# EAGLE schematic Battery_Monitoring_V2 (EAGLE 9.5.1)

## Sheet 1 of 2
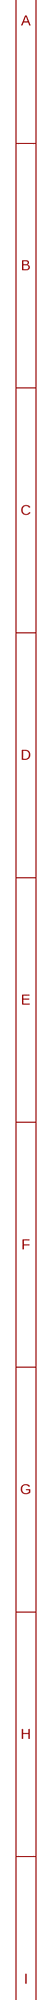
[diagram p0: schematic, sheet 1, part 1 of 2]
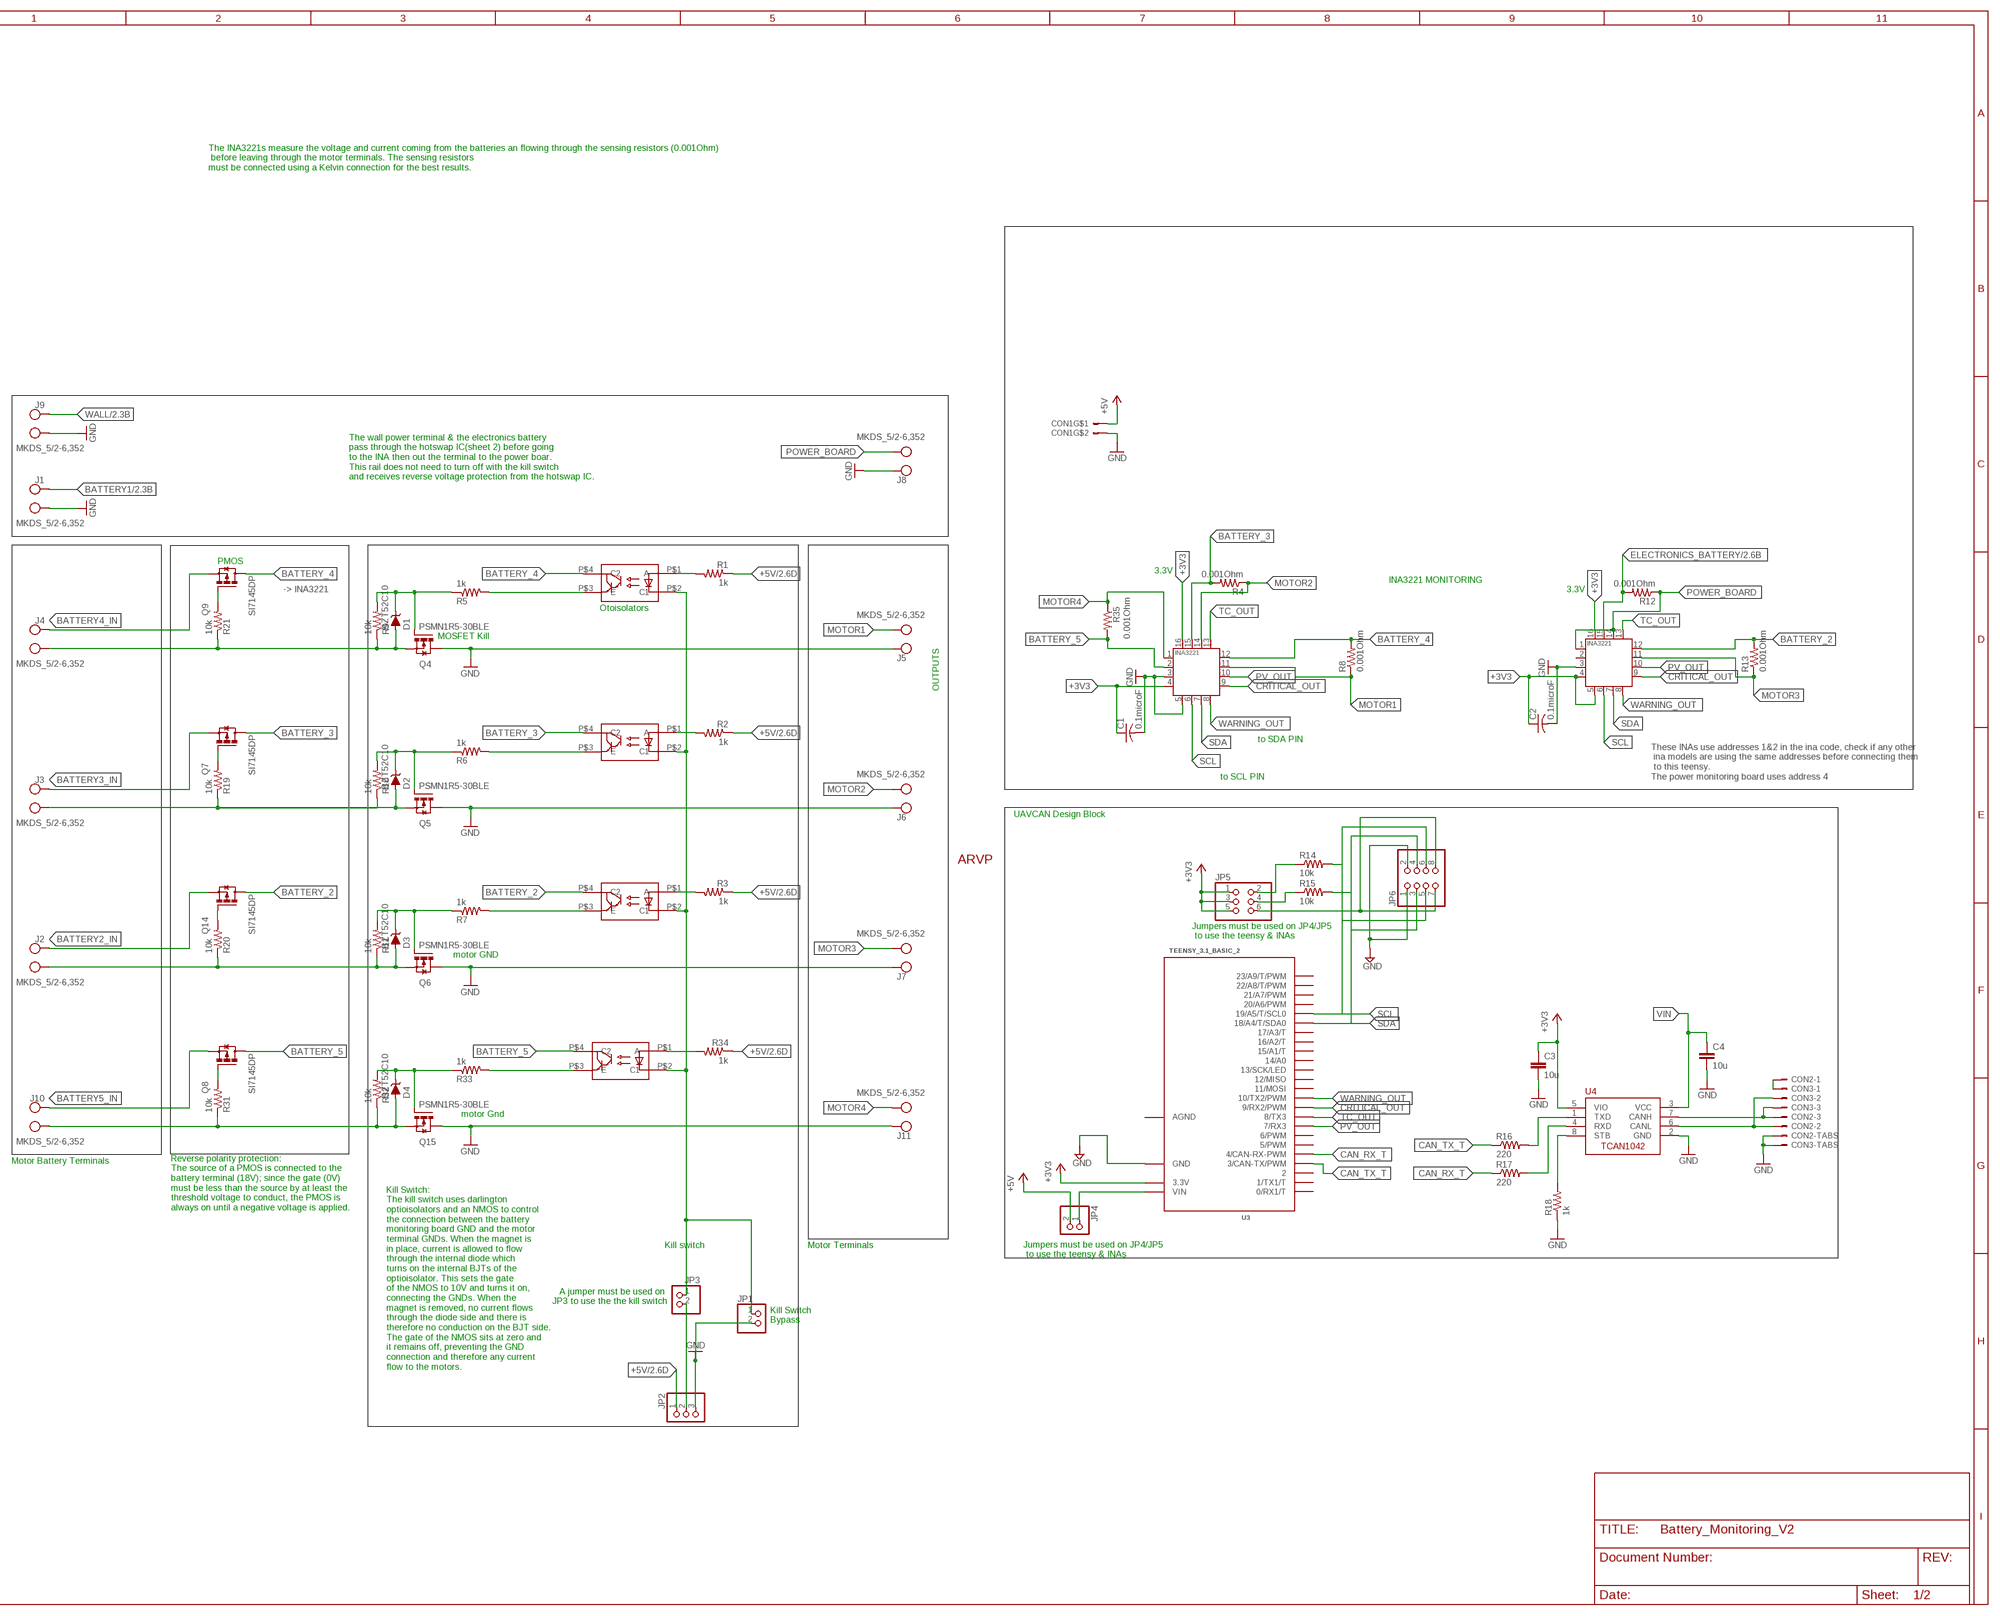
[diagram p1: schematic, sheet 1, part 2 of 2]

### Parts
ARVP1  ARVP_LOGO  [ARVP]
C1  0.1microF  C-USC2012  [C2012]
C2  0.1microF  C-USC2012  [C2012]
C3  10u  C-EUC0805  [C0805]
C4  10u  C-EUC0805  [C0805]
CON1  MOLEX_5566-2  [5566-2]
CON2  SM03B-GHS-TB  [SM03B-GHS-TB]
CON3  SM03B-GHS-TB  [SM03B-GHS-TB]
D1  BZT52C10  [SOD-123]
D2  BZT52C10  [SOD-123]
D3  BZT52C10  [SOD-123]
D4  BZT52C10  [SOD-123]
J1  MKDS_5/2-6,352  [MKDS_5/2-6,35]
J2  MKDS_5/2-6,352  [MKDS_5/2-6,35]
J3  MKDS_5/2-6,352  [MKDS_5/2-6,35]
J4  MKDS_5/2-6,352  [MKDS_5/2-6,35]
J5  MKDS_5/2-6,352  [MKDS_5/2-6,35]
J6  MKDS_5/2-6,352  [MKDS_5/2-6,35]
J7  MKDS_5/2-6,352  [MKDS_5/2-6,35]
J8  MKDS_5/2-6,352  [MKDS_5/2-6,35]
J9  MKDS_5/2-6,352  [MKDS_5/2-6,35]
J10  MKDS_5/2-6,352  [MKDS_5/2-6,35]
J11  MKDS_5/2-6,352  [MKDS_5/2-6,35]
JP1  PINHD-1X2  [1X02]
JP2  PINHD-1X3  [1X03]
JP3  PINHD-1X2  [1X02]
JP4  PINHD-1X2  [1X02]
JP5  PINHD-2X3  [2X03]
JP6  PINHD-2X4  [2X04]
Q1  TCLD1000CT  [SOP-4L]
Q2  TCLD1000CT  [SOP-4L]
Q3  TCLD1000CT  [SOP-4L]
Q4  PSMN1R5-30BLE  [SOT404/D2PAK]
Q5  PSMN1R5-30BLE  [SOT404/D2PAK]
Q6  PSMN1R5-30BLE  [SOT404/D2PAK]
Q7  SI7145DP  [SO-8/PPAK/TEST]
Q8  SI7145DP  [SO-8/PPAK/TEST]
Q9  SI7145DP  [SO-8/PPAK/TEST]
Q14  SI7145DP  [SO-8/PPAK/TEST]
Q15  PSMN1R5-30BLE  [SOT404/D2PAK]
Q16  TCLD1000CT  [SOP-4L]
R1  1k  R-US_R0805  [R0805]
R2  1k  R-US_R0805  [R0805]
R3  1k  R-US_R0805  [R0805]
R4  0.001Ohm  HCS3920FT1L00  [3920]
R5  1k  R-US_M1206  [M1206]
R6  1k  R-US_M1206  [M1206]
R7  1k  R-US_M1206  [M1206]
R8  0.001Ohm  HCS3920FT1L00  [3920]
R9  10k  R-US_M1206  [M1206]
R10  10k  R-US_M1206  [M1206]
R11  10k  R-US_M1206  [M1206]
R12  0.001Ohm  HCS3920FT1L00  [3920]
R13  0.001Ohm  HCS3920FT1L00  [3920]
R14  10k  R-US_R1206  [R1206]
R15  10k  R-US_R1206  [R1206]
R16  220  R-US_R0805  [R0805]
R17  220  R-US_R0805  [R0805]
R18  1k  R-US_R0805  [R0805]
R19  10k  R-US_M1206  [M1206]
R20  10k  R-US_M1206  [M1206]
R21  10k  R-US_M1206  [M1206]
R31  10k  R-US_M1206  [M1206]
R32  10k  R-US_M1206  [M1206]
R33  1k  R-US_M1206  [M1206]
R34  1k  R-US_R0805  [R0805]
R35  0.001Ohm  HCS3920FT1L00  [3920]
U1  INA3221.  [HVQFN16_4X4]
U2  INA3221.  [HVQFN16_4X4]
U3  TEENSY_3.1_BASIC_2  [TEENSY_3.1_BASIC_2]
U4  TCAN1042HVDR  [SO-8]

### Nets
+3V3: C1.1 C2.1 C3.1 JP5.1 JP5.3 JP5.5 U1.4(VS) U1.16(VPU) U2.4(VS) U2.5(A0) U2.16(VPU) U3.3.3V U4.5(VIO)
+5V: CON1.1 JP2.1 JP4.2 R1.1 R2.1 R3.1 ; also sheet 2
+5V/2.6D: R34.1
BATT1GND: D1.P$2(A) J4.1(KL) Q4.3S(S) R9.1 R21.1
BATT2GND: D2.P$2(A) J3.1(KL) Q5.3S(S) R10.1 R19.1
BATT3GND: D3.P$2(A) J2.1(KL) Q6.3S(S) R11.1 R20.1
BATTERY1: J1.2(KL1) ; also sheet 2
BATTERY2_IN: J2.2(KL1) Q14.S@1(S) Q14.S@2(S) Q14.S@3(S)
BATTERY3_IN: J3.2(KL1) Q7.S@1(S) Q7.S@2(S) Q7.S@3(S)
BATTERY4_IN: J4.2(KL1) Q9.S@1(S) Q9.S@2(S) Q9.S@3(S)
BATTERY5_IN: J10.2(KL1) Q8.S@1(S) Q8.S@2(S) Q8.S@3(S)
BATTERY_2: Q3.P$4(C2) Q14.D@1(D) Q14.D@2(D) Q14.D@3(D) Q14.D@4(D) Q14.D@5(D) R13.P$2 U2.12(IN+1)
BATTERY_3: Q2.P$4(C2) Q7.D@1(D) Q7.D@2(D) Q7.D@3(D) Q7.D@4(D) Q7.D@5(D) R4.P$2 U1.15(IN+2)
BATTERY_4: Q1.P$4(C2) Q9.D@1(D) Q9.D@2(D) Q9.D@3(D) Q9.D@4(D) Q9.D@5(D) R8.P$2 U1.12(IN+1)
BATTERY_5: Q8.D@1(D) Q8.D@2(D) Q8.D@3(D) Q8.D@4(D) Q8.D@5(D) Q16.P$4(C2) R35.P$2 U1.2(IN+3)
CAN_RX1: R17.2 U4.4(RXD)
CAN_RX_T: R17.1 U3.4(4/CAN-RX-PWM)
CAN_TX2: R16.2 U4.1(TXD)
CAN_TX_T: R16.1 U3.3(3/CAN-TX/PWM)
CANH1: CON2.P$3 CON3.P$3 U4.7(CANH)
CANL1: CON2.P$2 CON3.P$2 U4.6(CANL)
CANSH1: CON2.P$1 CON3.P$1
CRITICAL_OUT: U1.9(CRITICAL) U2.9(CRITICAL) U3.9(9/RX2/PWM)
E1: Q1.P$3(E) R5.2
E2: Q2.P$3(E) R6.2
E3: Q3.P$3(E) R7.2
ELECTRONICS_BATTERY: R12.P$2 U2.15(IN+2) ; also sheet 2
GND: C1.2 C2.2 C3.2 C4.2 CON1.2 CON2.P$4 CON2.P$5 CON3.P$4 CON3.P$5 J1.1(KL) J5.2(KL1) J6.2(KL1) J7.2(KL1) J8.2(KL1) J9.1(KL) J11.2(KL1) JP1.2 JP2.3 JP6.1 JP6.2 Q4.2D(D) Q5.2D(D) Q6.2D(D) Q15.2D(D) R18.1 U1.3(GND) U1.5(A0) U2.3(GND) U3.GND U4.2(GND) ; also sheet 2
I2C_3V1: JP5.6 JP6.7 JP6.8
MG1: D1.P$1(C) Q4.1G(G) R5.1 R9.2
MG2: D2.P$1(C) Q5.1G(G) R6.1 R10.2
MG3: D3.P$1(C) Q6.1G(G) R7.1 R11.2
MOTOR1: J5.1(KL) R8.P$1 U1.11(IN-1)
MOTOR2: J6.1(KL) R4.P$1 U1.14(IN-2)
MOTOR3: J7.1(KL) R13.P$1 U2.11(IN-1)
MOTOR4: J11.1(KL) R35.P$1 U1.1(IN-3)
N$1: Q1.P$1(A) R1.2
N$2: Q2.P$1(A) R2.2
N$3: Q3.P$1(A) R3.2
N$4: JP1.1 JP3.1 Q1.P$2(C1) Q2.P$2(C1) Q3.P$2(C1) Q16.P$2(C1)
N$5: JP2.2 JP3.2
N$6: Q7.G R19.2
N$7: Q14.G R20.2
N$9: Q9.G R21.2
N$10: Q8.G R31.2
N$12: D4.P$2(A) J10.1(KL) Q15.3S(S) R31.1 R32.1
N$13: D4.P$1(C) Q15.1G(G) R32.2 R33.1
N$15: Q16.P$3(E) R33.2
N$16: Q16.P$1(A) R34.2
POWER_BOARD: J8.1(KL) R12.P$1 U2.1(IN-3) U2.14(IN-2)
PV_OUT: U1.10(PV) U2.10(PV) U3.7(7/RX3)
SCL: JP6.5 JP6.6 R14.2 U1.6(SCL) U2.6(SCL) U3.19/A5(19/A5/T/SCL0)
SCL_3V1: JP5.2 R14.1
SDA: JP6.3 JP6.4 R15.2 U1.7(SDA) U2.7(SDA) U3.18/A4(18/A4/T/SDA0)
SDA_3V1: JP5.4 R15.1
STB1: R18.2 U4.8(STB)
TC_OUT: U1.13(TC) U2.13(TC) U3.8(8/TX3)
VIN: C4.1 JP4.1 U3.VIN U4.3(VCC)
WALL: J9.2(KL1) ; also sheet 2
WARNING_OUT: U1.8(WARNING) U2.8(WARNING) U3.10(10/TX2/PWM)
Unconnected: U2.2(IN+3) U3.0(0/RX1/T) U3.1(1/TX1/T) U3.2 U3.5(5/PWM) U3.6(6/PWM) U3.11(11/MOSI) U3.12(12/MISO) U3.13(13/SCK/LED) U3.14/A0 U3.15/A1(15/A1/T) U3.16/A2(16/A2/T) U3.17/A3(17/A3/T) U3.20/A6(20/A6/PWM) U3.21/A7(21/A7/PWM) U3.22/A8(22/A8/T/PWM) U3.23/A9(23/A9/T/PWM)

### Notes on the sheet
- The INA3221s measure the voltage and current coming from the batteries an flowing through the sensing resistors (0.001Ohm)
   before leaving through the motor terminals. The sensing resistors
  must be connected using a Kelvin connection for the best results.
- The wall power terminal & the electronics battery
  pass through the hotswap IC(sheet 2) before going 
  to the INA then out the terminal to the power boar. 
  This rail does not need to turn off with the kill switch 
  and receives reverse voltage protection from the hotswap IC.
- PMOS
- 3.3V
- INA3221 MONITORING
- -> INA3221 | 3.3V
- Otoisolators
- MOSFET Kill
- OUTPUTS
- to SDA PIN
- to SCL PIN
- These INAs use addresses 1&2 in the ina code, check if any other
   ina models are using the same addresses before connecting them
   to this teensy.
  The power monitoring board uses address 4
- UAVCAN Design Block
- Jumpers must be used on JP4/JP5
   to use the teensy & INAs
- motor GND
- motor Gnd
- Motor Battery Terminals
- Reverse polarity protection:
  The source of a PMOS is connected to the 
  battery terminal (18V); since the gate (0V) 
  must be less than the source by at least the 
  threshold voltage to conduct, the PMOS is 
  always on until a negative voltage is applied.
- Kill switch | Motor Terminals
- Jumpers must be used on JP4/JP5
   to use the teensy & INAs
- A jumper must be used on 
  JP3 to use the the kill switch
- Kill Switch 
  Bypass
- Kill Switch:
  The kill switch uses darlington 
  optioisolators and an NMOS to control 
  the connection between the battery 
  monitoring board GND and the motor 
  terminal GNDs. When the magnet is 
  in place, current is allowed to flow 
  through the internal diode which 
  turns on the internal BJTs of the 
  optioisolator. This sets the gate
  of the NMOS to 10V and turns it on,
  connecting the GNDs. When the 
  magnet is removed, no current flows 
  through the diode side and there is 
  therefore no conduction on the BJT side. 
  The gate of the NMOS sits at zero and 
  it remains off, preventing the GND 
  connection and therefore any current 
  flow to the motors.

## Sheet 2 of 2
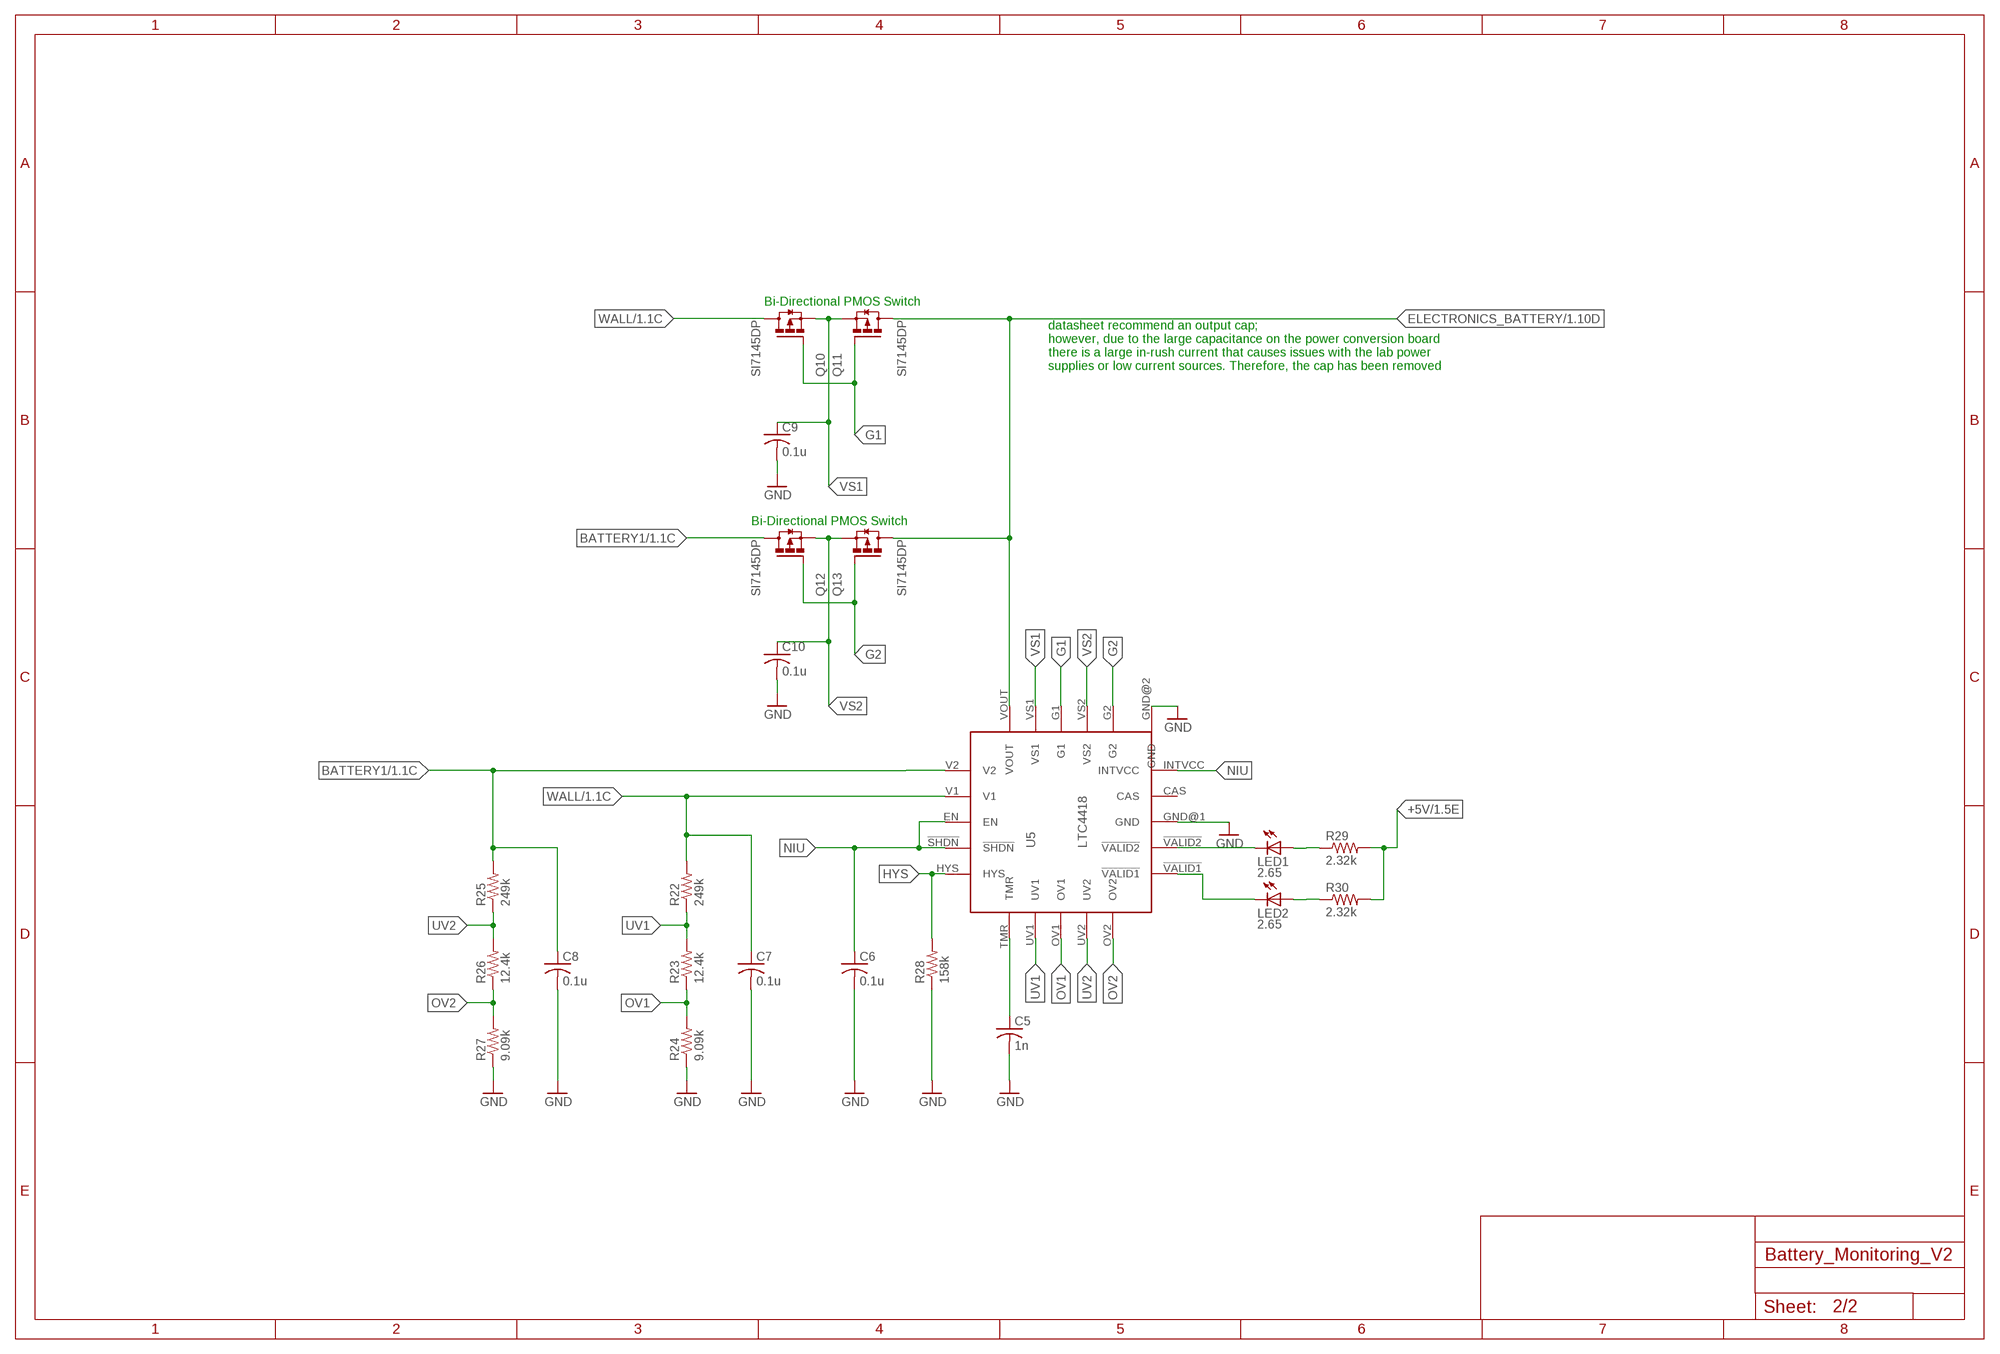
[diagram p2: schematic, sheet 2]

### Parts
C5  1n  C-USC0805  [C0805]
C6  0.1u  C-USC0805  [C0805]
C7  0.1u  C-USC0805  [C0805]
C8  0.1u  C-USC0805  [C0805]
C9  0.1u  C-USC0805  [C0805]
C10  0.1u  C-USC0805  [C0805]
LED1  2.65  LEDSML0805  [SML0805]
LED2  2.65  LEDSML0805  [SML0805]
Q10  SI7145DP  [SO-8/PPAK/TEST]
Q11  SI7145DP  [SO-8/PPAK/TEST]
Q12  SI7145DP  [SO-8/PPAK/TEST]
Q13  SI7145DP  [SO-8/PPAK/TEST]
R22  249k  R-US_R1206  [R1206]
R23  12.4k  R-US_R0805  [R0805]
R24  9.09k  R-US_R0805  [R0805]
R25  249k  R-US_R1206  [R1206]
R26  12.4k  R-US_R0805  [R0805]
R27  9.09k  R-US_R0805  [R0805]
R28  158k  R-US_R0805  [R0805]
R29  2.32k  R-US_R0805  [R0805]
R30  2.32k  R-US_R0805  [R0805]
U5  LTC4418  [20-QFN(4X4)]

### Nets
!VALID1: LED2.C U5.!VALID1
!VALID2: LED1.C U5.!VALID2
+5V: R29.2 R30.2 ; also sheet 1
BATTERY1: C8.1 Q12.D@1(D) Q12.D@2(D) Q12.D@3(D) Q12.D@4(D) Q12.D@5(D) R25.2 U5.V2 ; also sheet 1
ELECTRONICS_BATTERY: Q11.D@1(D) Q11.D@2(D) Q11.D@3(D) Q11.D@4(D) Q11.D@5(D) Q13.D@1(D) Q13.D@2(D) Q13.D@3(D) Q13.D@4(D) Q13.D@5(D) U5.VOUT ; also sheet 1
G1: Q10.G Q11.G U5.G1
G2: Q12.G Q13.G U5.G2
GND: C5.2 C6.2 C7.2 C8.2 C9.2 C10.2 R24.1 R27.1 R28.1 U5.GND@1(GND) U5.GND@2(GND) ; also sheet 1
HYS: R28.2 U5.HYS
N$8: LED1.A R29.1
N$11: LED2.A R30.1
N$14: C5.1 U5.TMR
NIU: C6.1 U5.!SHDN U5.EN U5.INTVCC
OV1: R23.1 R24.2 U5.OV1
OV2: R26.1 R27.2 U5.OV2
UV1: R22.1 R23.2 U5.UV1
UV2: R25.1 R26.2 U5.UV2
VS1: C9.1 Q10.S@1(S) Q10.S@2(S) Q10.S@3(S) Q11.S@1(S) Q11.S@2(S) Q11.S@3(S) U5.VS1
VS2: C10.1 Q12.S@1(S) Q12.S@2(S) Q12.S@3(S) Q13.S@1(S) Q13.S@2(S) Q13.S@3(S) U5.VS2
WALL: C7.1 Q10.D@1(D) Q10.D@2(D) Q10.D@3(D) Q10.D@4(D) Q10.D@5(D) R22.2 U5.V1 ; also sheet 1
Unconnected: U5.CAS

### Notes on the sheet
- Bi-Directional PMOS Switch
- datasheet recommend an output cap;
  however, due to the large capacitance on the power conversion board 
  there is a large in-rush current that causes issues with the lab power 
  supplies or low current sources. Therefore, the cap has been removed
- Bi-Directional PMOS Switch

## Power pins joined to a net without a drawn wire
AGND: U3.AGND

## Library data of the parts
ARVP1 = ARVP:ARVP_LOGO
C1 C2 = resistor:C-US: CAPACITOR, American symbol
C3 C4 = rcl:C-EU: CAPACITOR, European symbol
C5-C10 = adafruit:C-US: CAPACITOR, American symbol
CON1 = ARVP:MOLEX_5566-2
CON2 CON3 = ARVP:SM03B-GHS-TB
D1-D4 = Moira:BZT52C10: DIODE ZENER 10V 500MW SOD123 by Diodes Incorporated Digikey: BZT52C10-FDICT-ND
J1-J11 = Moira:MKDS_5/2-6,35: CONN TERM BLOCK 2POS 6.35MM PCB, 2 Position Wire to Board Terminal Block Horizontal with Board 0.250" (6.35mm) Through Hole, Phoenix Contact (1714955), Digikey:277-1269-ND, MKDS 5/2-6,35 package adpated from Eagle library package MKDS 5/3-6,35
JP1 JP3 JP4 = pinhead:PINHD-1X2: PIN HEADER
JP2 = pinhead:PINHD-1X3: PIN HEADER
JP5 = pinhead:PINHD-2X3: PIN HEADER
JP6 = pinhead:PINHD-2X4: PIN HEADER
LED1 LED2 = led:LED: LED OSRAM: - CHIPLED LG R971, LG N971, LY N971, LG Q971, LY Q971, LO R971, LY R971 LH N974, LH R974 LS Q976, LO Q976, LY Q976 LO Q996 - Hyper CHIPLED LW Q18S LB Q993, LB Q99A, LB R99A - SideLED LS A670, LO A670, LY A670, LG A670, LP A670 LB A673, LV A673, LT A673, LW A673 LH A674 LY A675 LS A676, LA A676, LO A676, LY A676, LW A676 LS A679, LY A679, LG A679 - Hyper Micro SIDELED® LS Y876, LA Y876, LO Y876, LY Y876 LT Y87S - SmartLED LW L88C, LW L88S LB L89C, LB L89S, LG L890 LS L89K, LO L89K, LY L89K LS L896, LA L896, LO L896, LY L896 - TOPLED LS T670, LO T670, LY T670, LG T670, LP T670 LSG T670, LSP T670, LSY T670, LOP T670, LYG T670 LG T671, LOG T671, LSG T671 LB T673, LV T673, LT T673, LW T673 LH T674 LS T676, LA T676, LO T676, LY T676, LB T676, LH T676, LSB T676, LW T676 LB T67C, LV T67C, LT T67C, LS T67K, LO T67K, LY T67K, LW E67C LS E67B, LA E67B, LO E67B, LY E67B, LB E67C, LV E67C, LT E67C LW T67C LS T679, LY T679, LG T679 LS T770, LO T770, LY T770, LG T770, LP T770 LB T773, LV T773, LT T773, LW T773 LH T774 LS E675, LA E675, LY E675, LS T675 LS T776, LA T776, LO T776, LY T776, LB T776 LHGB T686 LT T68C, LB T68C - Hyper Mini TOPLED® LB M676 - Mini TOPLED Santana® LG M470 LS M47K, LO M47K, LY M47K Source: http://www.osram.convergy.de LUXEON: - LUMILED® LXK2-PW12-R00, LXK2-PW12-S00, LXK2-PW14-U00, LXK2-PW14-V00 LXK2-PM12-R00, LXK2-PM12-S00, LXK2-PM14-U00 LXK2-PE12-Q00, LXK2-PE12-R00, LXK2-PE12-S00, LXK2-PE14-T00, LXK2-PE14-U00 LXK2-PB12-K00, LXK2-PB12-L00, LXK2-PB12-M00, LXK2-PB14-N00, LXK2-PB14-P00, LXK2-PB14-Q00 LXK2-PR12-L00, LXK2-PR12-M00, LXK2-PR14-Q00, LXK2-PR14-R00 LXK2-PD12-Q00, LXK2-PD12-R00, LXK2-PD12-S00 LXK2-PH12-R00, LXK2-PH12-S00 LXK2-PL12-P00, LXK2-PL12-Q00, LXK2-PL12-R00 Source: www.luxeon.com KINGBRIGHT: KA-3528ASYC Source: www.kingbright.com
Q1 = Moira:TCLD1000CT: OPTOISOLTR 5KV DARLINGTON 4-SOP by VISHAY Digikey: TCLD1000CT_ND; SPICEPREFIX: E
Q2 Q3 Q16 = Moira:TCLD1000CT: OPTOISOLTR 5KV DARLINGTON 4-SOP by VISHAY Digikey: TCLD1000CT_ND
Q4-Q6 Q15 = Moira:PSMN1R5-30BLE: N-channel 30 V 1.5 mΩ logic level MOSFET in D2PAK by Nexperia USA Inc. Digikey: 1727-1101-1-ND
Q7-Q9 Q14 = Si7145DP:SI7145DP: MOSFET P-CH 30V 60A PPAK SO-8 Digikey: SI7145DP-T1-GE3CT-ND; MPN: SI7145DP-T1-GE3; OC_NEWARK: 63R6006
Q10-Q13 = Moira:SI7145DP: MOSFET P-CH 30V 60A PPAK SO-8 Digikey: SI7145DP-T1-GE3CT-ND
R1-R3 R5-R7 R9-R11 R22-R30 R32-R34 = adafruit:R-US_: RESISTOR, American symbol
R4 R8 R12 R13 R35 = Moira:HCS3920: 0.001 Ohm ±1% 5W Chip Resistor 4020 Automotive AEC-Q200, Current Sense, Moisture Resistant Metal Element Stackpole Electronics Inc. Digikey: HCS3920FT1L00CT-ND
R14-R18 = rcl:R-US_: RESISTOR, American symbol
R19-R21 R31 = adafruit:R-US_: RESISTOR, American symbol; MPN: RC0603FR-0710KL; OC_NEWARK: 68R0049
U1 U2 = INA3221:INA3221: The INA3221 is a three-channel, high-side current and bus voltage monitor with an I 2C- and SMBUScompatible interface. The INA3221 monitors both shunt voltage drops and bus supply voltages, in addition to having programmable conversion times and averaging modes for these signals. The INA3221 offers both critical and warning alerts to detect multiple programmable out-of-range conditions for each channel.
U3 = Teensy_3_Series_Board_v1.0:TEENSY_3.1_BASIC_2: Footprint for Teensy 3.1 board using all pin connections on the outer perimeter
U4 = ARVP:TCAN1042HVDR
U5 = Moira:LTC4418: OR Controller Source Selector Switch P-Channel 2:1 20-QFN (4x4) Digikey: LTC4418IUF#PBF-ND

## Net classes
1 net1: clearance 0.203 mm to class 0